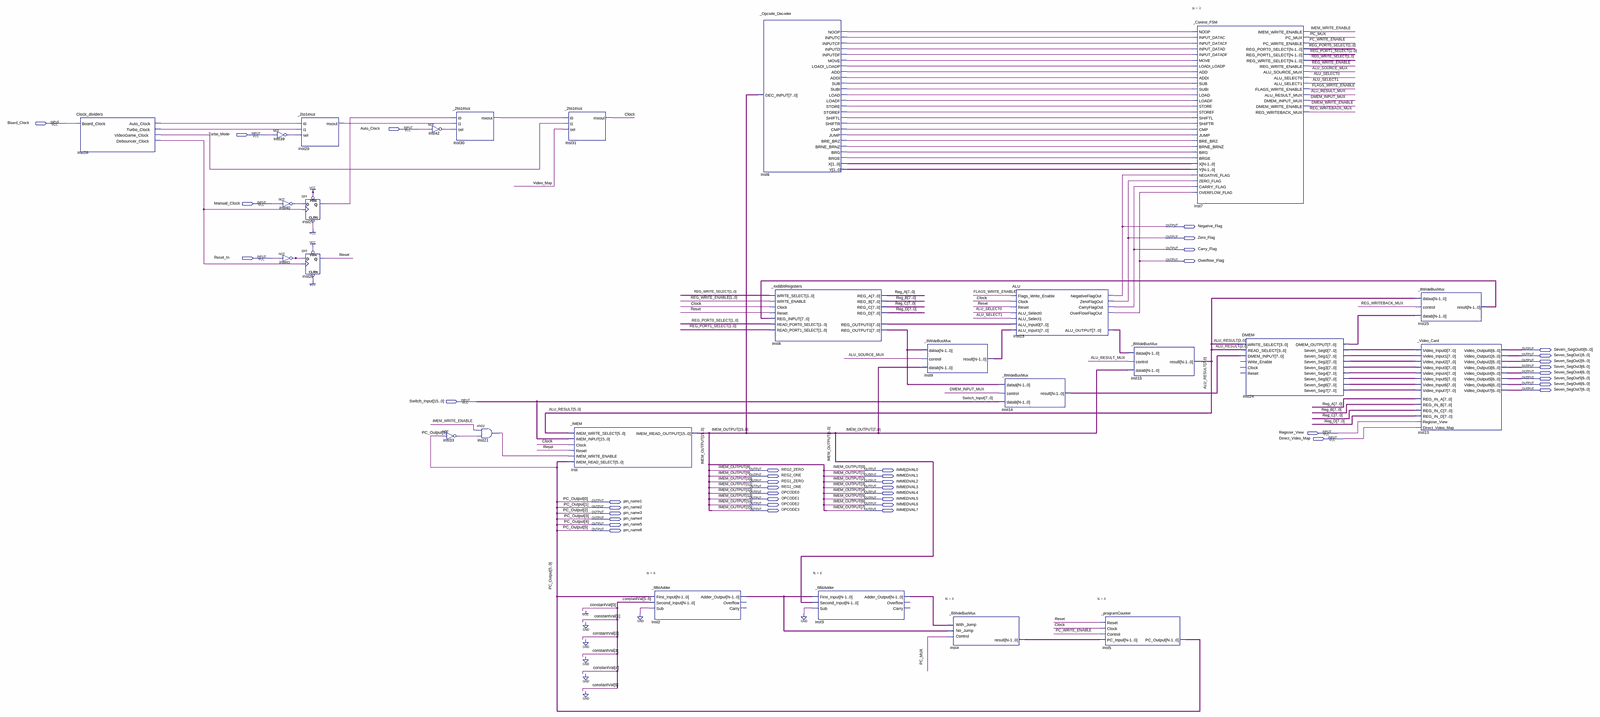
[diagram p0: schematic sheet, whole]
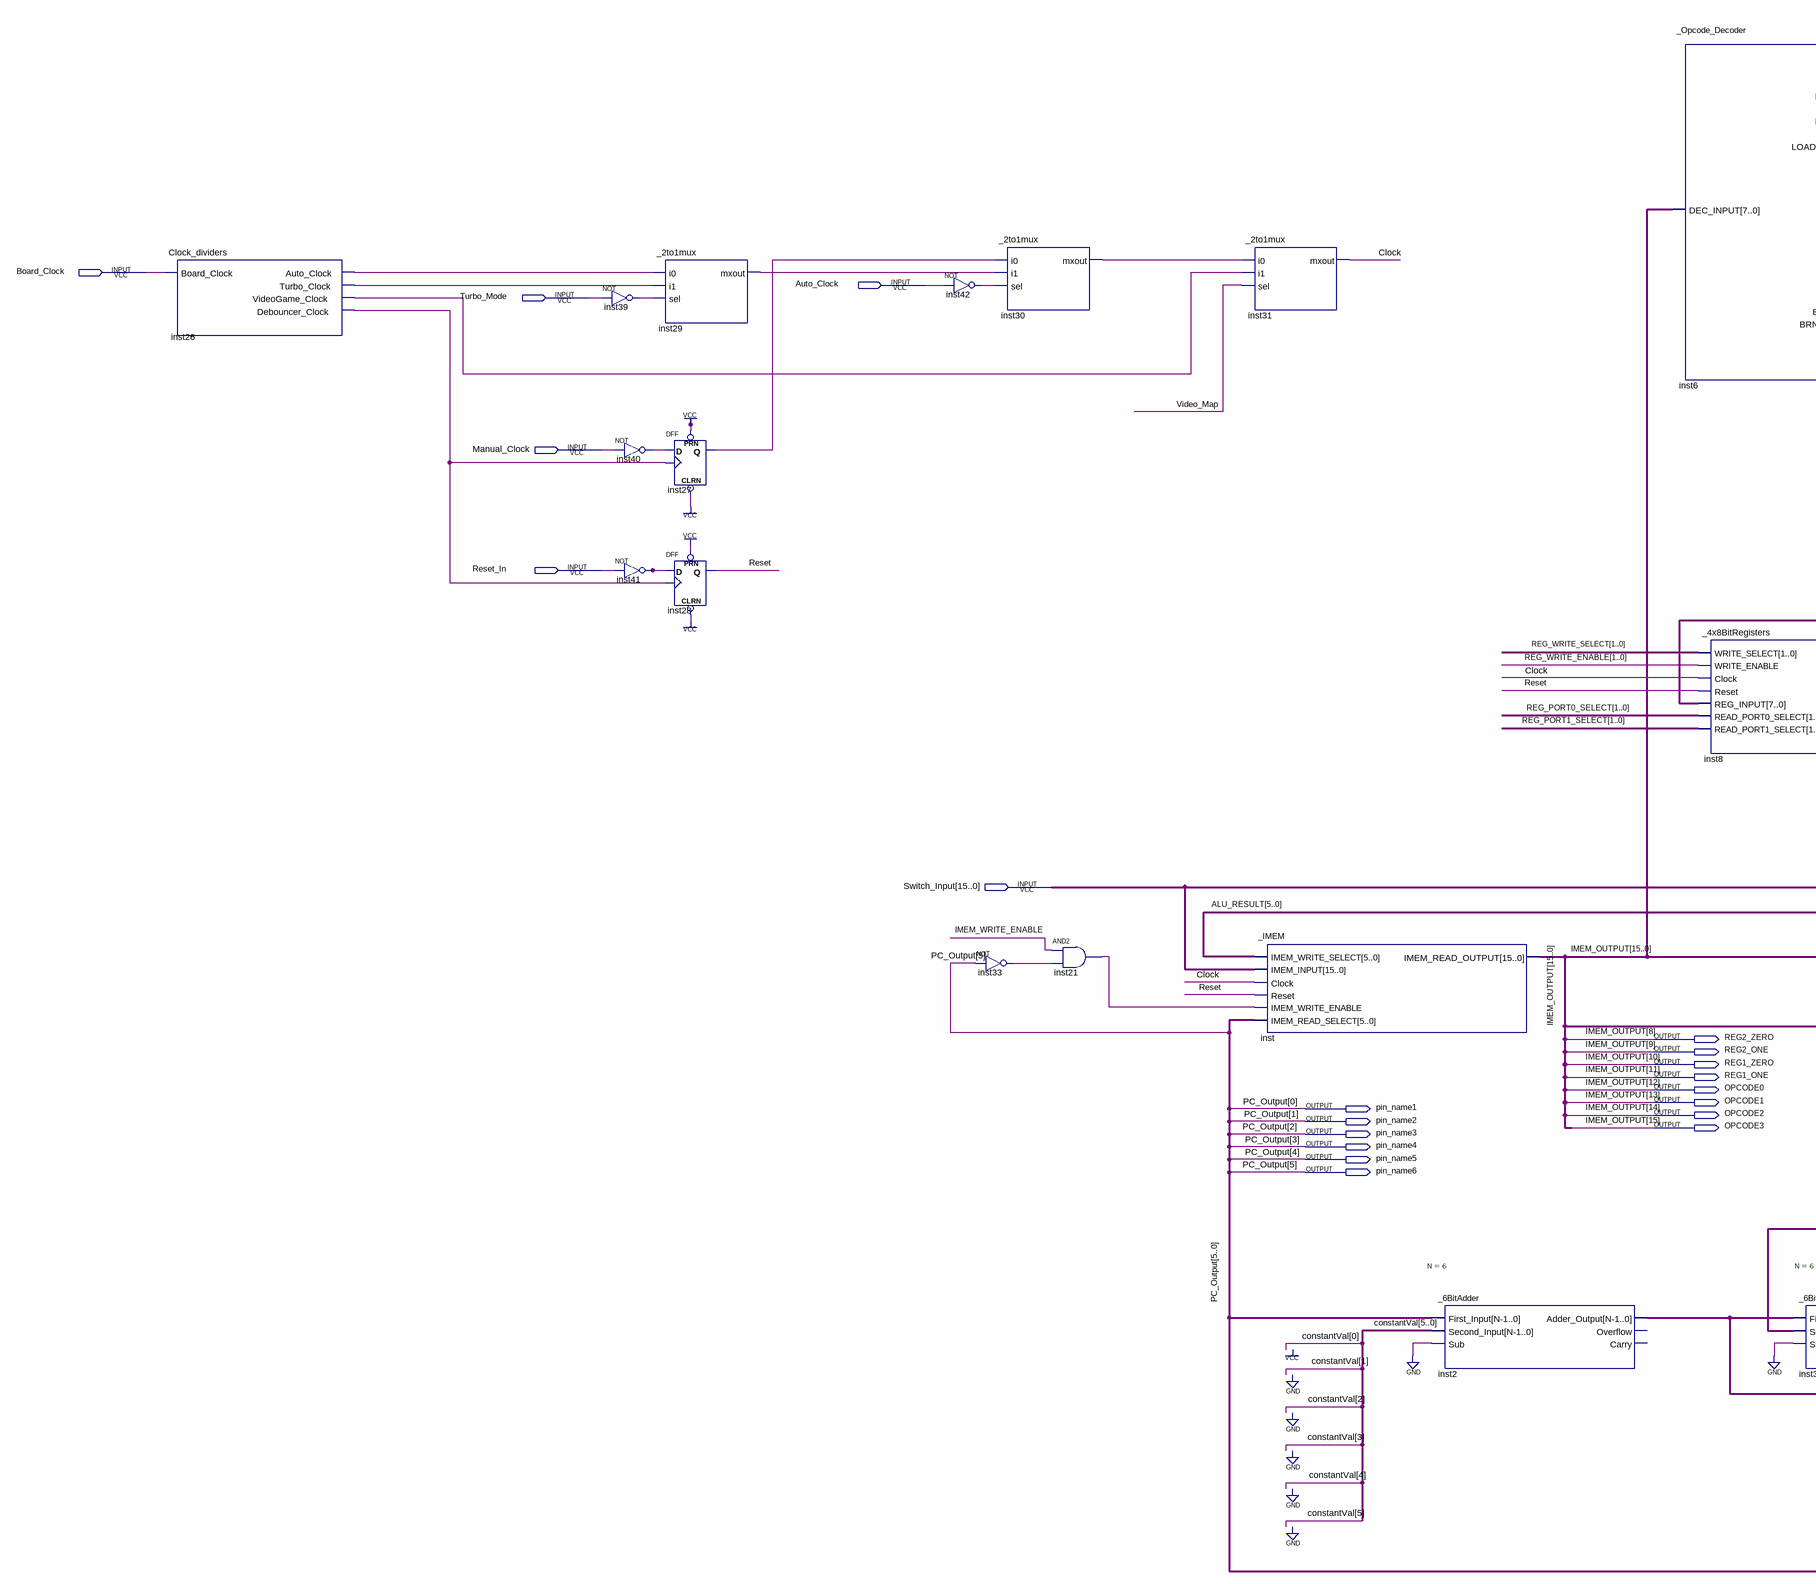
[diagram p1: schematic sheet, left part]
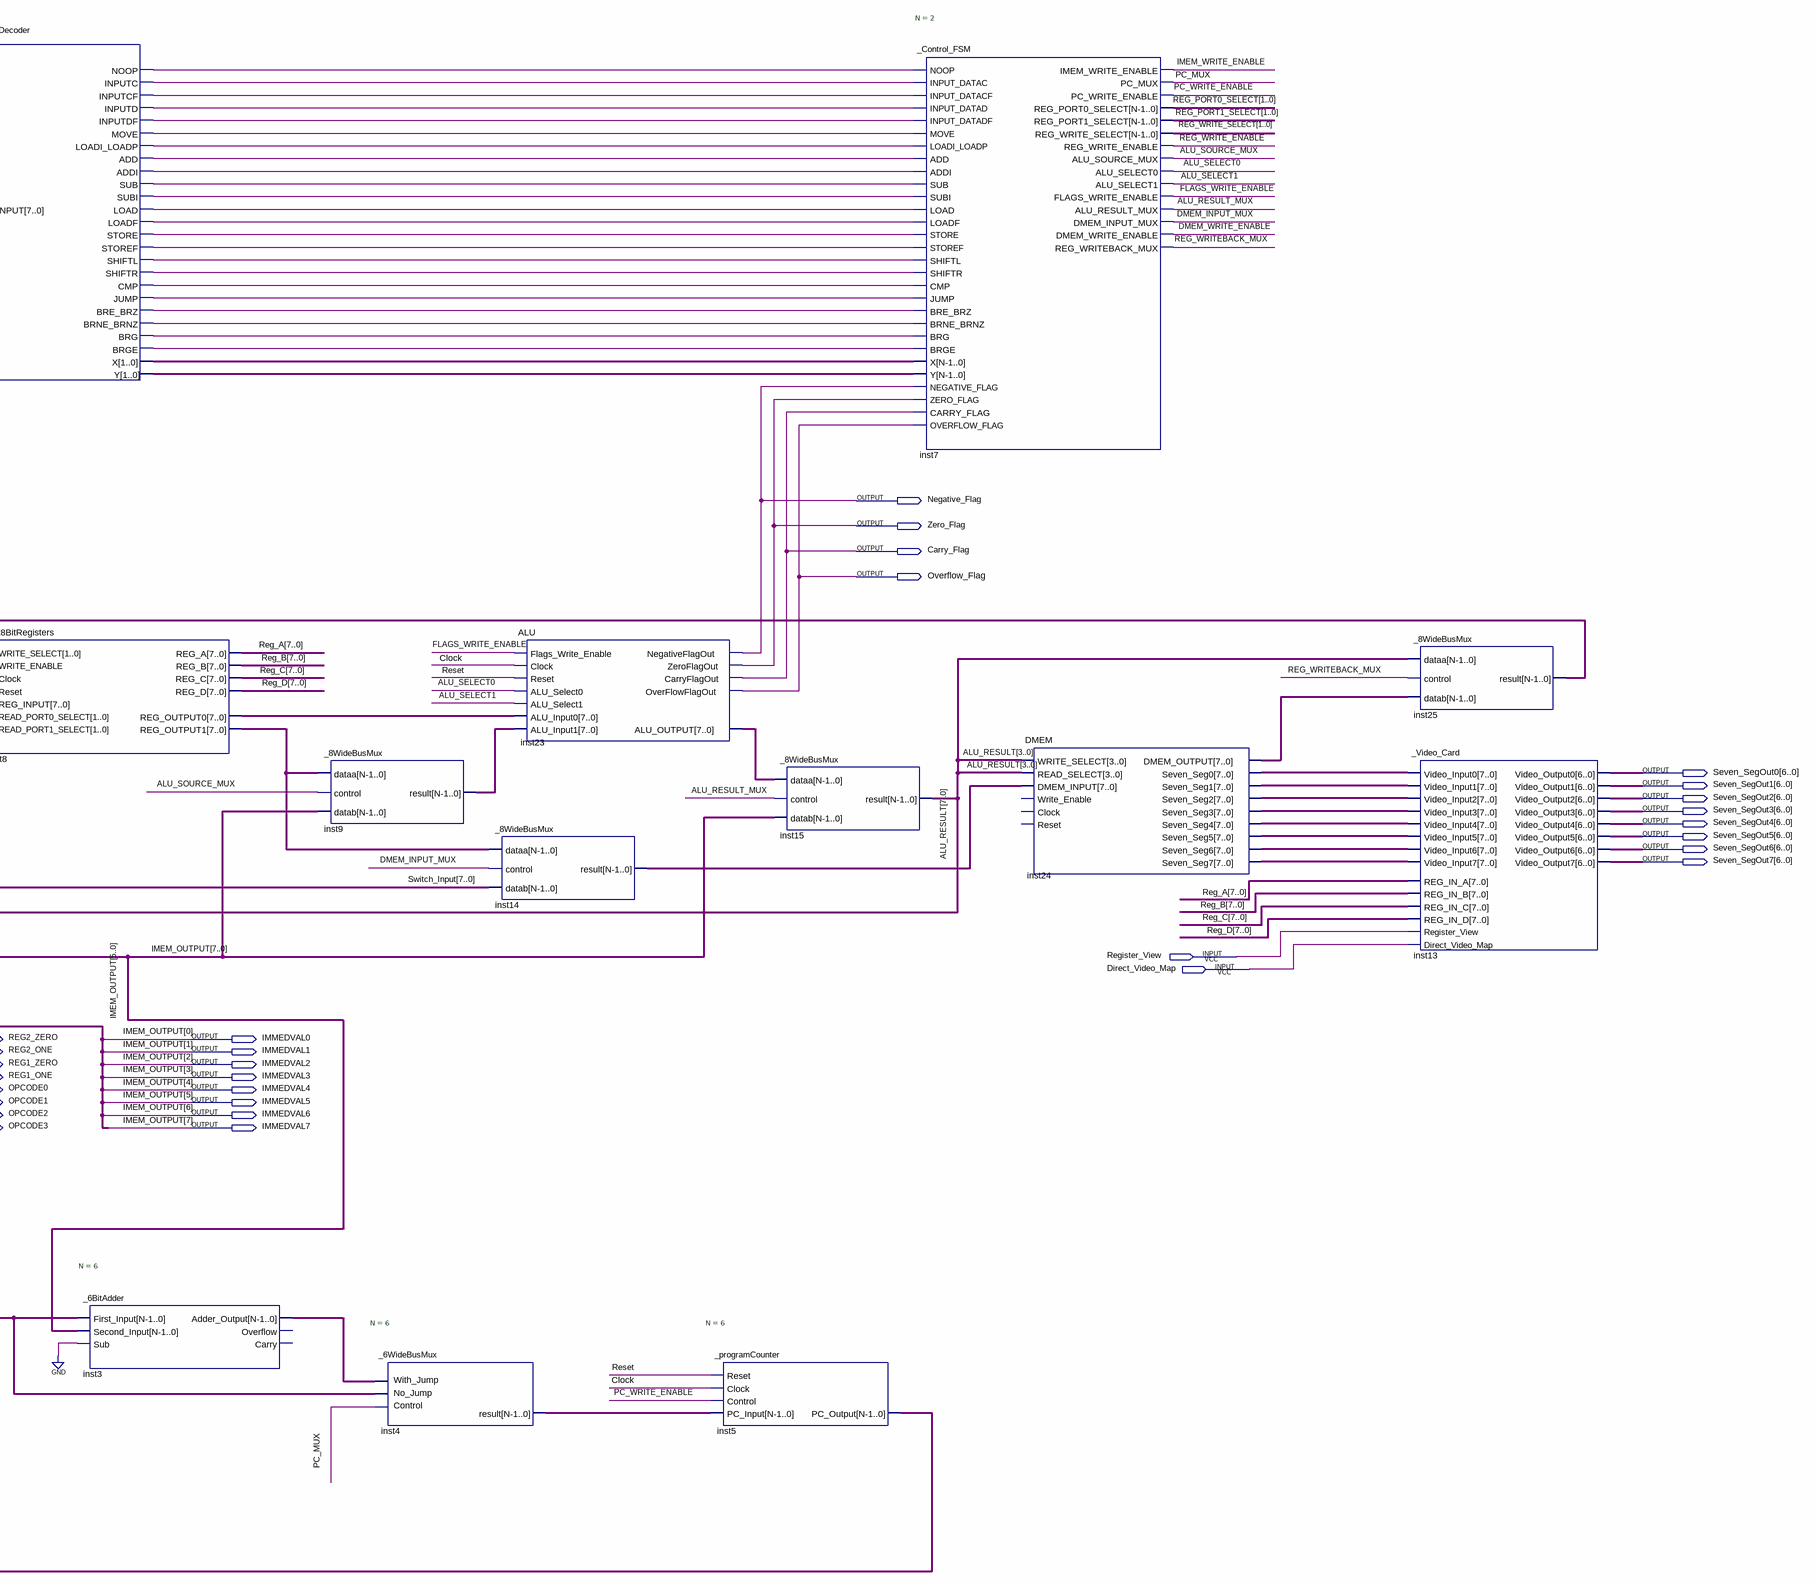
[diagram p2: schematic sheet, right part]
// Quartus schematic i281.bdf as structural Verilog: 27 symbols, 42 pins
module i281 (
  input  Board_Clock,
  input  Auto_Clock,
  input  Turbo_Mode,
  input  Manual_Clock,
  input  Reset_In,
  input  [15:0] Switch_Input,
  input  Register_View,
  input  Direct_Video_Map,
  output Negative_Flag,
  output Zero_Flag,
  output Carry_Flag,
  output Overflow_Flag,
  output [6:0] Seven_SegOut0,
  output [6:0] Seven_SegOut1,
  output [6:0] Seven_SegOut2,
  output [6:0] Seven_SegOut3,
  output [6:0] Seven_SegOut4,
  output [6:0] Seven_SegOut5,
  output [6:0] Seven_SegOut6,
  output [6:0] Seven_SegOut7,
  output REG2_ZERO,
  output IMMEDVAL0,
  output REG2_ONE,
  output IMMEDVAL1,
  output REG1_ZERO,
  output IMMEDVAL2,
  output REG1_ONE,
  output IMMEDVAL3,
  output OPCODE0,
  output IMMEDVAL4,
  output OPCODE1,
  output IMMEDVAL5,
  output pin_name1,
  output OPCODE2,
  output IMMEDVAL6,
  output pin_name2,
  output OPCODE3,
  output IMMEDVAL7,
  output pin_name3,
  output pin_name4,
  output pin_name5,
  output pin_name6
);

  wire ALU_RESULT_MUX, ALU_SELECT0, ALU_SELECT1, ALU_SOURCE_MUX, Clock, DMEM_INPUT_MUX, DMEM_WRITE_ENABLE,
       FLAGS_WRITE_ENABLE, IMEM_WRITE_ENABLE, inst6_add, inst6_addi, inst6_bre_brz, inst6_brg, inst6_brge,
       inst6_brne_brnz, inst6_cmp, inst6_inputc, inst6_inputcf, inst6_inputd, inst6_inputdf, inst6_jump,
       inst6_load, inst6_loadf, inst6_loadi_loadp, inst6_move, inst6_noop, inst6_shiftl, inst6_shiftr,
       inst6_store, inst6_storef, inst6_sub, inst6_subi, inst21_out, inst26_auto_clock,
       inst26_debouncer_clock, inst26_turbo_clock, inst26_videogame_clock, inst27_q, inst29_mxout,
       inst30_mxout, inst33_out, inst39_out, inst40_out, inst41_out, inst42_out, PC_MUX, PC_WRITE_ENABLE,
       REG_WRITE_ENABLE_1bit, REG_WRITEBACK_MUX, Reset, Video_Map;
  wire [1:0] inst6_x, inst6_y, REG_PORT0_SELECT, REG_PORT1_SELECT, REG_WRITE_ENABLE, REG_WRITE_SELECT;
  wire [5:0] constantVal, inst2_adder_output, inst3_adder_output, inst4_result;
  wire [7:0] ALU_RESULT, inst8_reg_output0, inst8_reg_output1, inst9_result, inst14_result,
       inst23_alu_output, inst24_dmem_output, inst24_seven_seg0, inst24_seven_seg1, inst24_seven_seg2,
       inst24_seven_seg3, inst24_seven_seg4, inst24_seven_seg5, inst24_seven_seg6, inst24_seven_seg7,
       inst25_result, Reg_A, Reg_B, Reg_C, Reg_D;

  Clock_dividers inst26 (
    .Board_Clock(Board_Clock), .Auto_Clock(inst26_auto_clock), .Turbo_Clock(inst26_turbo_clock),
    .VideoGame_Clock(inst26_videogame_clock), .Debouncer_Clock(inst26_debouncer_clock));
  not inst39 (inst39_out, Turbo_Mode);
  _2to1mux inst29 (.i0(inst26_auto_clock), .i1(inst26_turbo_clock), .sel(inst39_out), .mxout(inst29_mxout));
  not inst40 (inst40_out, Manual_Clock);
  not inst41 (inst41_out, Reset_In);
  DFF inst27 (.CLRN(1'b1), .CLK(inst26_debouncer_clock), .D(inst40_out), .PRN(1'b1), .Q(inst27_q));
  DFF inst28 (.CLRN(1'b1), .CLK(inst26_debouncer_clock), .D(inst41_out), .PRN(1'b1), .Q(Reset));
  not inst42 (inst42_out, Auto_Clock);
  _2to1mux inst30 (.i0(inst27_q), .i1(inst29_mxout), .sel(inst42_out), .mxout(inst30_mxout));
  not inst33 (inst33_out, pin_name6);
  and inst21 (inst21_out, IMEM_WRITE_ENABLE, inst33_out);
  _2to1mux inst31 (.i0(inst30_mxout), .i1(inst26_videogame_clock), .sel(Video_Map), .mxout(Clock));
  _IMEM inst (
    .Clock(Clock), .Reset(Reset), .IMEM_WRITE_ENABLE(inst21_out),
    .IMEM_READ_SELECT({pin_name6, pin_name5, pin_name4, pin_name3, pin_name2, pin_name1}),
    .IMEM_WRITE_SELECT(ALU_RESULT[5:0]), .IMEM_INPUT(Switch_Input),
    .IMEM_READ_OUTPUT({OPCODE3, OPCODE2, OPCODE1, OPCODE0, REG1_ONE, REG1_ZERO, REG2_ONE, REG2_ZERO, IMMEDVAL7, IMMEDVAL6, IMMEDVAL5, IMMEDVAL4, IMMEDVAL3, IMMEDVAL2, IMMEDVAL1, IMMEDVAL0}));
  _6BitAdder #(.N(6)) inst2 (
    .First_Input({pin_name6, pin_name5, pin_name4, pin_name3, pin_name2, pin_name1}),
    .Second_Input(constantVal), .Sub(1'b0), .Adder_Output(inst2_adder_output));  // open: Carry, Overflow
  _Opcode_Decoder inst6 (
    .DEC_INPUT({OPCODE3, OPCODE2, OPCODE1, OPCODE0, REG1_ONE, REG1_ZERO, REG2_ONE, REG2_ZERO, IMMEDVAL7, IMMEDVAL6, IMMEDVAL5, IMMEDVAL4, IMMEDVAL3, IMMEDVAL2, IMMEDVAL1, IMMEDVAL0}),
    .X(inst6_x), .Y(inst6_y), .NOOP(inst6_noop), .MOVE(inst6_move), .LOADI_LOADP(inst6_loadi_loadp),
    .ADD(inst6_add), .ADDI(inst6_addi), .SUB(inst6_sub), .SUBI(inst6_subi), .LOAD(inst6_load),
    .LOADF(inst6_loadf), .STORE(inst6_store), .STOREF(inst6_storef), .CMP(inst6_cmp), .JUMP(inst6_jump),
    .INPUTC(inst6_inputc), .INPUTCF(inst6_inputcf), .INPUTD(inst6_inputd), .INPUTDF(inst6_inputdf),
    .SHIFTL(inst6_shiftl), .SHIFTR(inst6_shiftr), .BRE_BRZ(inst6_bre_brz), .BRNE_BRNZ(inst6_brne_brnz),
    .BRG(inst6_brg), .BRGE(inst6_brge));
  _4x8BitRegisters inst8 (
    .REG_INPUT(inst25_result), .READ_PORT0_SELECT(REG_PORT0_SELECT), .WRITE_SELECT(REG_WRITE_SELECT),
    .READ_PORT1_SELECT(REG_PORT1_SELECT), .Clock(Clock), .Reset(Reset), .WRITE_ENABLE(REG_WRITE_ENABLE),
    .REG_A(Reg_A), .REG_B(Reg_B), .REG_C(Reg_C), .REG_D(Reg_D), .REG_OUTPUT0(inst8_reg_output0),
    .REG_OUTPUT1(inst8_reg_output1));
  _6BitAdder #(.N(6)) inst3 (
    .First_Input(inst2_adder_output),
    .Second_Input({IMMEDVAL5, IMMEDVAL4, IMMEDVAL3, IMMEDVAL2, IMMEDVAL1, IMMEDVAL0}), .Sub(1'b0),
    .Adder_Output(inst3_adder_output));  // open: Carry, Overflow
  _8WideBusMux inst9 (
    .dataa(inst8_reg_output1),
    .datab({IMMEDVAL7, IMMEDVAL6, IMMEDVAL5, IMMEDVAL4, IMMEDVAL3, IMMEDVAL2, IMMEDVAL1, IMMEDVAL0}),
    .control(ALU_SOURCE_MUX), .result(inst9_result));
  _6WideBusMux #(.N(6)) inst4 (
    .Control(PC_MUX), .dataAline(inst2_adder_output), .dataBline(inst3_adder_output), .result(inst4_result));
  _8WideBusMux inst14 (
    .dataa(inst8_reg_output1), .datab(Switch_Input[7:0]), .control(DMEM_INPUT_MUX), .result(inst14_result));
  ALU inst23 (
    .ALU_Select0(ALU_SELECT0), .ALU_Input0(inst8_reg_output0), .ALU_Select1(ALU_SELECT1),
    .ALU_Input1(inst9_result), .Clock(Clock), .Reset(Reset), .Flags_Write_Enable(FLAGS_WRITE_ENABLE),
    .ALU_OUTPUT(inst23_alu_output), .NegativeFlagOut(Negative_Flag), .ZeroFlagOut(Zero_Flag),
    .CarryFlagOut(Carry_Flag), .OverFlowFlagOut(Overflow_Flag));
  _programCounter #(.N(6)) inst5 (
    .PC_Input(inst4_result), .Control(PC_WRITE_ENABLE), .Clock(Clock), .Reset(Reset),
    .PC_Output({pin_name6, pin_name5, pin_name4, pin_name3, pin_name2, pin_name1}));
  _8WideBusMux inst15 (
    .dataa(inst23_alu_output),
    .datab({IMMEDVAL7, IMMEDVAL6, IMMEDVAL5, IMMEDVAL4, IMMEDVAL3, IMMEDVAL2, IMMEDVAL1, IMMEDVAL0}),
    .control(ALU_RESULT_MUX), .result(ALU_RESULT));
  _Control_FSM #(.N(2)) inst7 (
    .BRGE(inst6_brge), .BRG(inst6_brg), .BRNE_BRNZ(inst6_brne_brnz), .BRE_BRZ(inst6_bre_brz),
    .JUMP(inst6_jump), .CMP(inst6_cmp), .SHIFTR(inst6_shiftr), .SHIFTL(inst6_shiftl), .STOREF(inst6_storef),
    .STORE(inst6_store), .LOADF(inst6_loadf), .LOAD(inst6_load), .SUBI(inst6_subi), .SUB(inst6_sub),
    .ADDI(inst6_addi), .ADD(inst6_add), .LOADI_LOADP(inst6_loadi_loadp), .MOVE(inst6_move),
    .INPUT_DATADF(inst6_inputdf), .INPUT_DATAD(inst6_inputd), .INPUT_DATACF(inst6_inputcf),
    .INPUT_DATAC(inst6_inputc), .NOOP(inst6_noop), .X(inst6_x), .Y(inst6_y), .CARRY_FLAG(Carry_Flag),
    .OVERFLOW_FLAG(Overflow_Flag), .NEGATIVE_FLAG(Negative_Flag), .ZERO_FLAG(Zero_Flag),
    .IMEM_WRITE_ENABLE(IMEM_WRITE_ENABLE), .PC_MUX(PC_MUX), .PC_WRITE_ENABLE(PC_WRITE_ENABLE),
    .REG_PORT0_SELECT(REG_PORT0_SELECT), .REG_PORT1_SELECT(REG_PORT1_SELECT),
    .REG_WRITE_SELECT(REG_WRITE_SELECT), .REG_WRITE_ENABLE(REG_WRITE_ENABLE_1bit),
    .ALU_SOURCE_MUX(ALU_SOURCE_MUX), .ALU_SELECT0(ALU_SELECT0), .ALU_SELECT1(ALU_SELECT1),
    .FLAGS_WRITE_ENABLE(FLAGS_WRITE_ENABLE), .ALU_RESULT_MUX(ALU_RESULT_MUX),
    .DMEM_INPUT_MUX(DMEM_INPUT_MUX), .DMEM_WRITE_ENABLE(DMEM_WRITE_ENABLE),
    .REG_WRITEBACK_MUX(REG_WRITEBACK_MUX));
  DMEM inst24 (
    .WRITE_SELECT(ALU_RESULT[3:0]), .DMEM_INPUT(inst14_result), .READ_SELECT(ALU_RESULT[3:0]),
    .Seven_Seg7(inst24_seven_seg7), .Seven_Seg6(inst24_seven_seg6), .Seven_Seg5(inst24_seven_seg5),
    .Seven_Seg4(inst24_seven_seg4), .Seven_Seg3(inst24_seven_seg3), .Seven_Seg2(inst24_seven_seg2),
    .Seven_Seg1(inst24_seven_seg1), .Seven_Seg0(inst24_seven_seg0), .DMEM_OUTPUT(inst24_dmem_output));  // open: Write_Enable, Clock, Reset
  _8WideBusMux inst25 (
    .dataa(ALU_RESULT), .datab(inst24_dmem_output), .control(REG_WRITEBACK_MUX), .result(inst25_result));
  _Video_Card inst13 (
    .Direct_Video_Map(Direct_Video_Map), .Register_View(Register_View), .Video_Input0(inst24_seven_seg0),
    .Video_Input1(inst24_seven_seg1), .Video_Input2(inst24_seven_seg2), .Video_Input3(inst24_seven_seg3),
    .Video_Input4(inst24_seven_seg4), .Video_Input5(inst24_seven_seg5), .Video_Input6(inst24_seven_seg6),
    .Video_Input7(inst24_seven_seg7), .REG_IN_A(Reg_A), .REG_IN_B(Reg_B), .REG_IN_C(Reg_C), .REG_IN_D(Reg_D),
    .Video_Output0(Seven_SegOut0), .Video_Output1(Seven_SegOut1), .Video_Output2(Seven_SegOut2),
    .Video_Output3(Seven_SegOut3), .Video_Output4(Seven_SegOut4), .Video_Output5(Seven_SegOut5),
    .Video_Output6(Seven_SegOut6), .Video_Output7(Seven_SegOut7));

  // Other names for the same wires on the sheet: IMEM_OUTPUT[15:0] = {OPCODE3, OPCODE2, OPCODE1, OPCODE0, REG1_ONE, REG1_ZERO, REG2_ONE, REG2_ZERO, IMMEDVAL7, IMMEDVAL6, IMMEDVAL5, IMMEDVAL4, IMMEDVAL3, IMMEDVAL2, IMMEDVAL1, IMMEDVAL0};
  //   PC_Output[5:0] = {pin_name6, pin_name5, pin_name4, pin_name3, pin_name2, pin_name1}
endmodule
